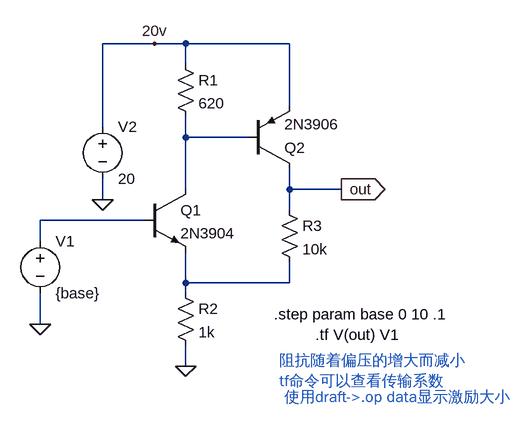
[diagram p0: schematic Draft1.asc]
Draft1.asc, the LTspice schematic file:
Version 4
SHEET 1 880 680
WIRE 256 64 176 64
WIRE 304 64 256 64
WIRE 464 64 304 64
WIRE 304 96 304 64
WIRE 464 160 464 64
WIRE 176 192 176 64
WIRE 304 208 304 176
WIRE 400 208 304 208
WIRE 304 288 304 208
WIRE 464 288 464 256
WIRE 544 288 464 288
WIRE 176 304 176 272
WIRE 464 320 464 288
WIRE 240 336 80 336
WIRE 80 368 80 336
WIRE 304 432 304 384
WIRE 464 432 464 400
WIRE 464 432 304 432
WIRE 304 448 304 432
WIRE 80 496 80 448
WIRE 304 560 304 528
FLAG 80 496 0
FLAG 176 304 0
FLAG 304 560 0
FLAG 544 288 out
IOPIN 544 288 Out
FLAG 256 64 20v
SYMBOL Voltage 80 352 R0
SYMATTR InstName V1
SYMATTR Value {base}
SYMBOL Voltage 176 176 R0
SYMATTR InstName V2
SYMATTR Value 20
SYMBOL Res 288 80 R0
SYMATTR InstName R1
SYMATTR Value 620
SYMBOL npn 240 288 R0
SYMATTR InstName Q1
SYMATTR Value 2N3904
SYMBOL Res 288 432 R0
SYMATTR InstName R2
SYMATTR Value 1k
SYMBOL pnp 400 256 M180
SYMATTR InstName Q2
SYMATTR Value 2N3906
SYMBOL Res 448 304 R0
SYMATTR InstName R3
SYMATTR Value 10k
TEXT 440 480 Left 2 !.step param base 0 10 .1
TEXT 504 512 Left 2 !.tf V(out) V1
TEXT 448 552 Left 2 ;阻抗随着偏压的增大而减小\ntf命令可以查看传输系数
TEXT 456 608 Left 2 ;使用draft->.op data显示激励大小

The netlist it stands for:
* Draft1.asc
V1 N002 0 {base}
V2 20v 0 20
R1 20v N001 620
Q1 N001 N002 N003 0 2N3904
R2 N003 0 1k
Q2 out N001 20v 0 2N3906
R3 out N003 10k
.model NPN NPN
.model PNP PNP
.lib standard.bjt
.step param base 0 10 .1
.tf V(out) V1
* 阻抗随着偏压的增大而减小
* tf命令可以查看传输系数
* 使用draft->.op data显示激励大小
.backanno
.end